# Altium schematic sheet RigadoBreakout.SchDoc
size A
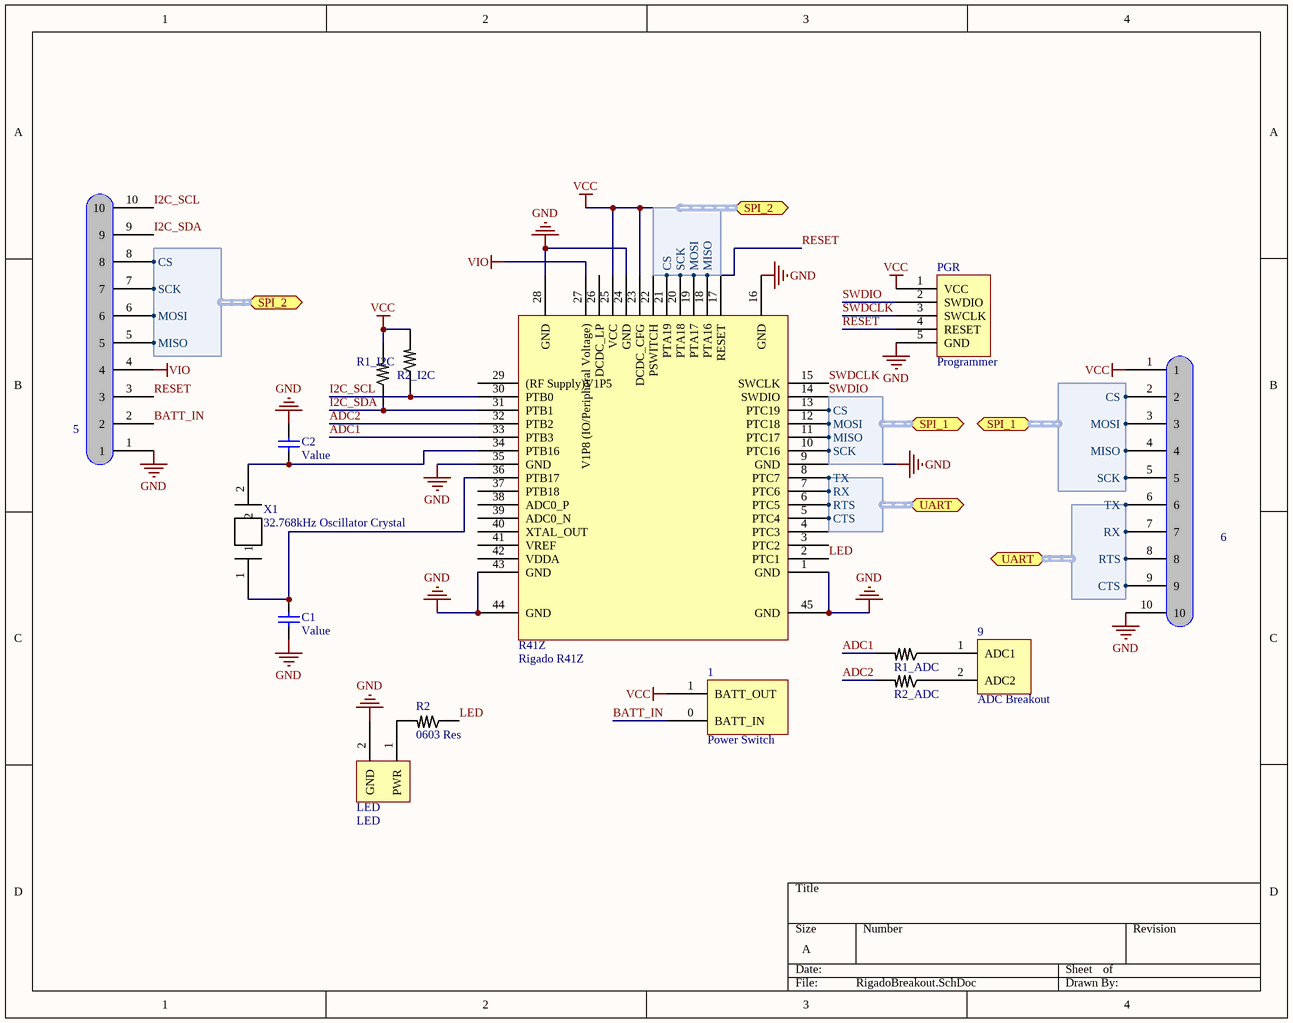
[diagram p0: RigadoBreakout.SchDoc]

## Parts
1  Power Switch  [SMT_SWITCH - duplicate]
5  Pin Breakout  [10Pin_Breakout]  (value not drawn)
6  Pin Breakout  [10Pin_Breakout]  (value not drawn)
9  ADC Breakout  [ADC Breakout]
C1  Cap  [0603/1608 SMD Resistor]  (value not drawn)
C2  Cap  [0603/1608 SMD Resistor]  (value not drawn)
LED  LED  [SMD0603]
PGR  Programmer  [Programmer]
R1_ADC  0603 Res  [0603/1608 SMD Resistor]  (value not drawn)
R1_I2C  0603 Res  [0603/1608 SMD Resistor]  (value not drawn)
R2  0603 Res  [0603/1608 SMD Resistor]
R2_ADC  0603 Res  [0603/1608 SMD Resistor]  (value not drawn)
R2_I2C  0603 Res  [0603/1608 SMD Resistor]  (value not drawn)
R41Z  Rigado R41Z  [RigadoR41Z]
X1  32.768kHz Oscillator Crystal  [Oscillator]

## Ports
SPI_1 (harness SPI Harness), SPI_2 (harness SPI Harness), UART (harness UART Harness)

## Harnesses
SPI Harness: MISO, MOSI, SCK, CS
SPI Harness: CS, SCK, MOSI, MISO
UART Harness: TX, RX, RTS, CTS

## Nets
GND: 5.1 6.10 C1.2 C2.1 LED.2(GND) PGR.5(GND) R41Z.1(GND) R41Z.9(GND) R41Z.16(GND) R41Z.24(GND) R41Z.28(GND) R41Z.35(GND) R41Z.43(GND) R41Z.44(GND) R41Z.45(GND)
VCC: 1.1(BATT_OUT) 6.1 PGR.1(VCC) R1_I2C.2 R2_I2C.2 R41Z.22(PSWITCH) R41Z.23(DCDC_CFG) R41Z.25(VCC)
VIO: 5.4 R41Z.27(V1P8_(IO/Peripheral_Voltage))
ADC1: R1_ADC.2 R41Z.33(PTB3)
ADC2: R2_ADC.2 R41Z.32(PTB2)
BATT_IN: 1.0(BATT_IN) 5.2
I2C_SCL: 5.10 R2_I2C.1 R41Z.30(PTB0)
I2C_SDA: 5.9 R1_I2C.1 R41Z.31(PTB1)
LED: R2.1 R41Z.2(PTC1)
RESET: 5.3 PGR.4(RESET) R41Z.17(RESET)
SWDCLK: PGR.3(SWCLK) R41Z.15(SWCLK)
SWDIO: PGR.2(SWDIO) R41Z.14(SWDIO)
Net5_5: 5.5 R41Z.18(PTA16) ; port SPI_2.MISO
Net5_6: 5.6 R41Z.19(PTA17) ; port SPI_2.MOSI
Net5_7: 5.7 R41Z.20(PTA18) ; port SPI_2.SCK
Net5_8: 5.8 R41Z.21(PTA19) ; port SPI_2.CS
Net6_2: 6.2 R41Z.13(PTC19) ; port SPI_1.CS
Net6_3: 6.3 R41Z.12(PTC18) ; port SPI_1.MOSI
Net6_4: 6.4 R41Z.11(PTC17) ; port SPI_1.MISO
Net6_5: 6.5 R41Z.10(PTC16) ; port SPI_1.SCK
Net6_6: 6.6 R41Z.8(PTC7) ; port UART.TX
Net6_7: 6.7 R41Z.7(PTC6) ; port UART.RX
Net6_8: 6.8 R41Z.6(PTC5) ; port UART.RTS
Net6_9: 6.9 R41Z.5(PTC4) ; port UART.CTS
Net9_1: 9.1(ADC1) R1_ADC.1
Net9_2: 9.2(ADC2) R2_ADC.1
NetC1_1: C1.1 R41Z.36(PTB17) X1.1
NetC2_2: C2.2 R41Z.34(PTB16) X1.2
NetLED_1: LED.1(PWR) R2.2

Not connected (* = marked no-connect by the designer): R41Z 3(PTC2) 4(PTC3) 26(DCDC_LP) 29((RF_Supply)V1P5) 37(PTB18) 38(ADC0_P) 39(ADC0_N) 40(XTAL_OUT) 41(VREF) 42(VDDA)

## Library data of the parts
C1 C2 = Capacitor Ceramic: Ceramic Chip Capacitor; Value: Value
X1 = 32.768kHz Oscillator Crystal: 32.768kHz Crystal Oscillator.  Note that this requires load capacitors; ComponentLink1URL: http://search.digikey.com/scripts/DkSearch/dksus.dll?Detail&name=X985-ND; ComponentLink1Description: Digikey link for 20MHz Oscillator